# EasyEDA schematic SCH_AOG Test Board_2023-11-17.json
TITLE: Sheet_1; REV: 1.0; Date: 2023-11-17; Sheet: 1/1; Company: Your Company
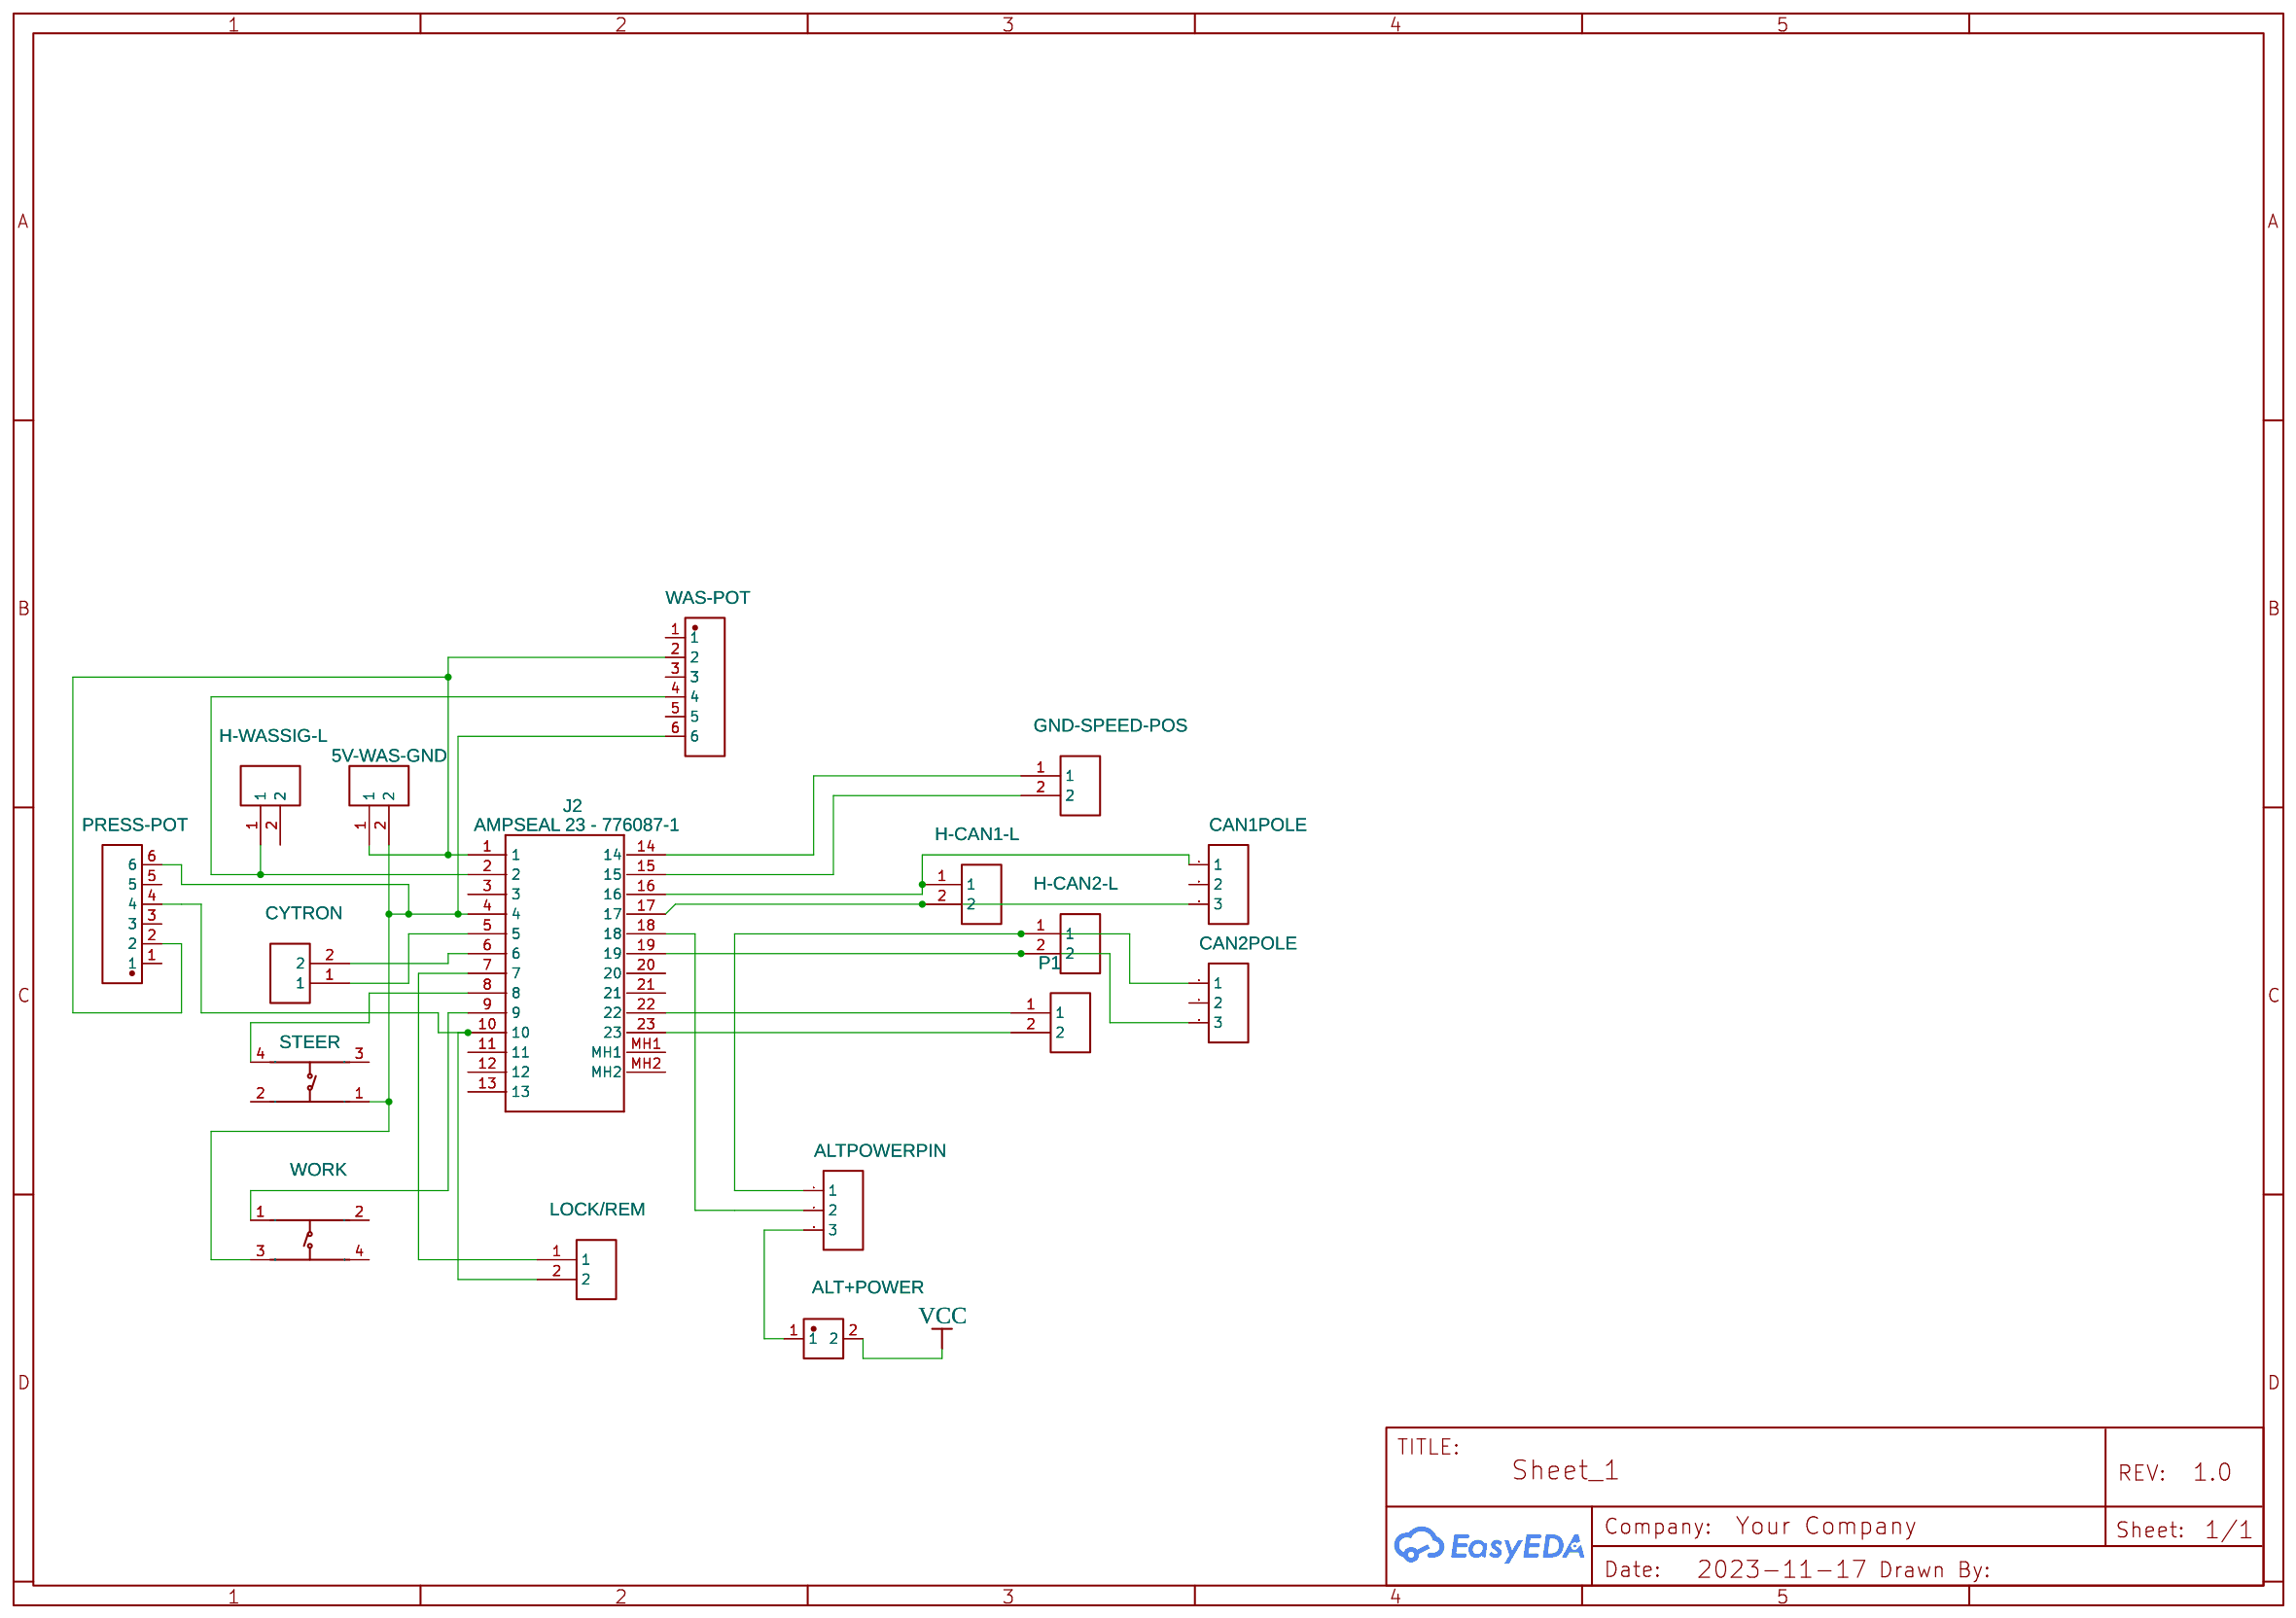
[diagram p0: schematic sheet]

## Parts
5V-WAS-GND  WJ500V-5.08-2P-14-00A  [CONN-TH_2P-P5.00_WJ500V-5.08-2P]
ALT+POWER  EST026  [CONN-TH_L6.3-W0.8-EST026]
ALTPOWERPIN  Header-Male-2.54_1x3  [HDR-TH_3P-P2.54-V-M-1]
CAN1POLE  Header-Male-2.54_1x3  [HDR-TH_3P-P2.54-V-M-1]
CAN2POLE  Header-Male-2.54_1x3  [HDR-TH_3P-P2.54-V-M-1]
CYTRON  WJ500V-5.08-2P-14-00A  [CONN-TH_2P-P5.00_WJ500V-5.08-2P]
GND-SPEED-POS  WJ500V-5.08-2P-14-00A  [CONN-TH_2P-P5.00_WJ500V-5.08-2P]
H-CAN1-L  WJ500V-5.08-2P-14-00A  [CONN-TH_2P-P5.00_WJ500V-5.08-2P]
H-CAN2-L  WJ500V-5.08-2P-14-00A  [CONN-TH_2P-P5.00_WJ500V-5.08-2P]
H-WASSIG-L  WJ500V-5.08-2P-14-00A  [CONN-TH_2P-P5.00_WJ500V-5.08-2P]
J2  AMPSEAL 23 - 776087-1  [7760871]
LOCK/REM  WJ500V-5.08-2P-14-00A  [CONN-TH_2P-P5.00_WJ500V-5.08-2P]
P1  WJ500V-5.08-2P-14-00A  [CONN-TH_2P-P5.00_WJ500V-5.08-2P]
PRESS-POT  Header-Female-2.54_1x6  [HDR-TH_6P-P2.54-V-F]
STEER  TS665CJ  [SW-TH_4P-L6.0-W6.0-P4.50-LS6.5]
WAS-POT  Header-Female-2.54_1x6  [HDR-TH_6P-P2.54-V-F]
WORK  TS665CJ  [SW-TH_4P-L6.0-W6.0-P4.50-LS6.5]

## Library data of the parts
5V-WAS-GND CYTRON GND-SPEED-POS H-CAN1-L H-CAN2-L H-WASSIG-L LOCK/REM P1 = WJ500V-5.08-2P-14-00A: Supplier: LCSC; Manufacturer: KANGNEX(康奈克斯电气); Manufacturer Part: WJ500V-5.08-2P; Supplier Part: C8465; JLCPCB Part Class: Extended Part; link: https://lcsc.com/eda_search?q=C8465&%26type=1&ref=editor
ALT+POWER = EST026: Contributor: LCSC; Supplier: LCSC; Supplier Part: C52878; Manufacturer: xcfuse(旭程); JLCPCB Part Class: Extended Part; link: https://lcsc.com/eda_search?q=C52878&%26type=1&ref=editor
ALTPOWERPIN CAN1POLE CAN2POLE = Header-Male-2.54_1x3: Supplier: LCSC; Manufacturer: BOOMELE(博穆精密); Manufacturer Part: 2.54-1*3P针; Supplier Part: C49257; JLCPCB Part Class: Extended Part; link: https://lcsc.com/eda_search?q=C49257&%26type=1&ref=editor; Contributor: lcsc; 3DModel: HDR-M-2.54_1x3
J2 = AMPSEAL 23 - 776087-1: Contributor: aKKoufen; Link: https://fr.rs-online.com/web/p/embases-circuits-imprimes/7181471; Code RS: 718-1471; Ref Fabricant: 776087-1; Marque: TE Connectivity; Supplier Part: C378893
PRESS-POT WAS-POT = Header-Female-2.54_1x6: Supplier: LCSC; Manufacturer: BOOMELE(博穆精密); Manufacturer Part: 2.54-1*6P母; Supplier Part: C40877; JLCPCB Part Class: Extended Part; link: https://lcsc.com/eda_search?q=C40877&%26type=1&ref=editor
STEER WORK = TS665CJ: Contributor: LCSC; Supplier: LCSC; Supplier Part: C393938; Manufacturer: SHOU HAN(首韩); JLCPCB Part Class: Extended Part; link: https://lcsc.com/eda_search?q=C393938&%26type=1&ref=editor

## Nets
VCC: ALT+POWER.2
Net-(5V-WAS-GND-1): 5V-WAS-GND.1 J2.1 PRESS-POT.2 WAS-POT.2
Net-(5V-WAS-GND-2): 5V-WAS-GND.2 J2.4 PRESS-POT.6 STEER.1(A) WAS-POT.6 WORK.3(C)
Net-(ALT+POWER-1): ALT+POWER.1 ALTPOWERPIN.3
Net-(ALTPOWERPIN-1): ALTPOWERPIN.1 CAN2POLE.1 H-CAN2-L.1
Net-(ALTPOWERPIN-2): ALTPOWERPIN.2 J2.18
Net-(CAN1POLE-1): CAN1POLE.1 H-CAN1-L.1 J2.16
Net-(CAN1POLE-3): CAN1POLE.3 H-CAN1-L.2 J2.17
Net-(CAN2POLE-3): CAN2POLE.3 H-CAN2-L.2 J2.19
Net-(CYTRON-1): CYTRON.1 J2.5
Net-(CYTRON-2): CYTRON.2 J2.6
Net-(GND-SPEED-POS-1): GND-SPEED-POS.1 J2.14
Net-(GND-SPEED-POS-2): GND-SPEED-POS.2 J2.15
Net-(H-WASSIG-L-1): H-WASSIG-L.1 J2.2 WAS-POT.4
Net-(J2-7): J2.7 LOCK/REM.1
Net-(J2-8): J2.8 STEER.4(D)
Net-(J2-9): J2.9 WORK.1(A)
Net-(J2-10): J2.10 LOCK/REM.2 PRESS-POT.4
Net-(J2-22): J2.22 P1.1
Net-(J2-23): J2.23 P1.2

Not connected (* = marked no-connect by the designer): CAN1POLE 2; CAN2POLE 2; H-WASSIG-L 2; J2 3 11 12 13 20 21 MH1 MH2; PRESS-POT 1 3 5; STEER 2(B) 3(C); WAS-POT 1 3 5; WORK 2(B) 4(D)
